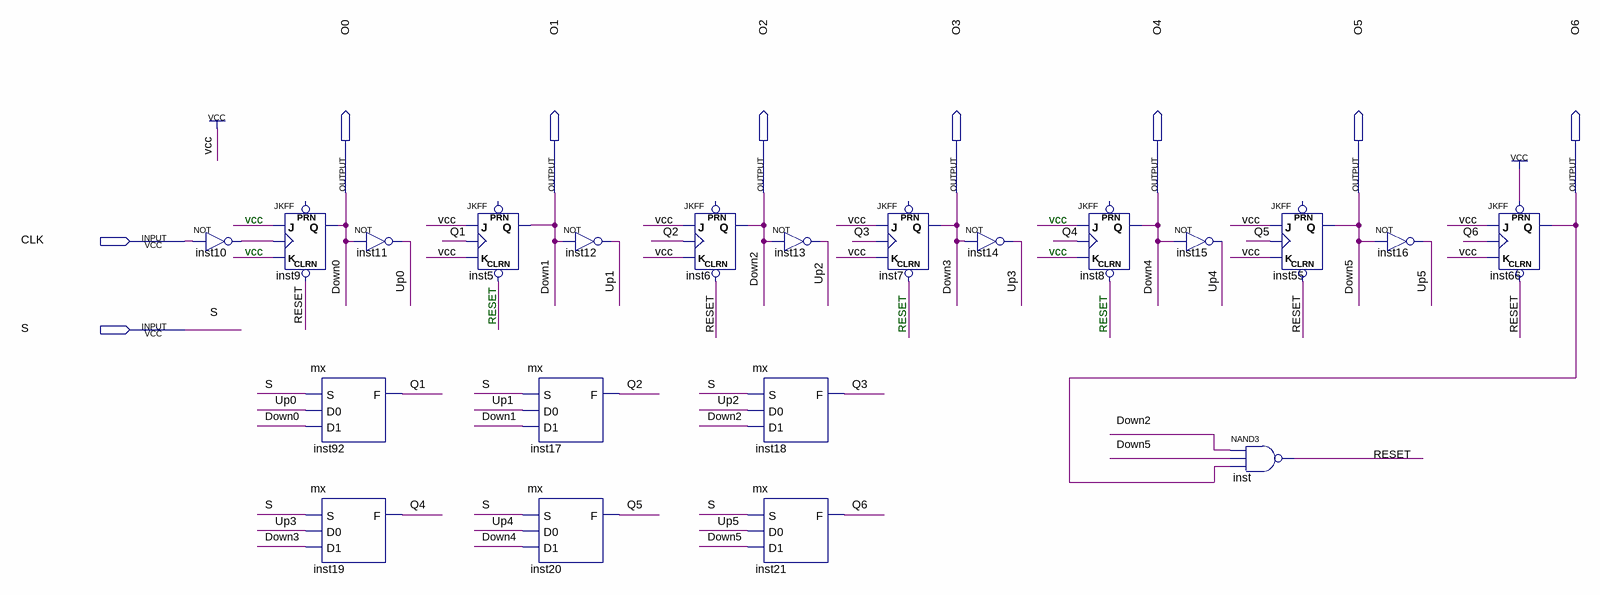
[diagram p0: schematic sheet]
// Quartus schematic UP.bdf as structural Verilog: 21 symbols, 9 pins
module UP (
  input  CLK,
  input  S,
  output O0,
  output O1,
  output O2,
  output O3,
  output O4,
  output O5,
  output O6
);

  wire inst10_out, Q1, Q2, Q3, Q4, Q5, Q6, RESET, Up0, Up1, Up2, Up3, Up4, Up5;

  not inst10 (inst10_out, CLK);
  JKFF inst9 (.CLRN(RESET), .K(1'b1), .J(1'b1), .CLK(inst10_out), .Q(O0));  // open: PRN
  not inst11 (Up0, O0);
  mx inst92 (.S(S), .D0(Up0), .D1(O0), .F(Q1));
  mx inst19 (.S(S), .D0(Up3), .D1(O3), .F(Q4));
  JKFF inst5 (.CLRN(RESET), .K(1'b1), .J(1'b1), .CLK(Q1), .Q(O1));  // open: PRN
  mx inst17 (.S(S), .D0(Up1), .D1(O1), .F(Q2));
  mx inst20 (.S(S), .D0(Up4), .D1(O4), .F(Q5));
  not inst12 (Up1, O1);
  JKFF inst6 (.CLRN(RESET), .K(1'b1), .J(1'b1), .CLK(Q2), .Q(O2));  // open: PRN
  mx inst18 (.S(S), .D0(Up2), .D1(O2), .F(Q3));
  mx inst21 (.S(S), .D0(Up5), .D1(O5), .F(Q6));
  not inst13 (Up2, O2);
  JKFF inst7 (.CLRN(RESET), .K(1'b1), .J(1'b1), .CLK(Q3), .Q(O3));  // open: PRN
  not inst14 (Up3, O3);
  JKFF inst8 (.CLRN(RESET), .K(1'b1), .J(1'b1), .CLK(Q4), .Q(O4));  // open: PRN
  not inst15 (Up4, O4);
  nand inst (RESET, O2, O5, O6);
  JKFF inst55 (.CLRN(RESET), .K(1'b1), .J(1'b1), .CLK(Q5), .Q(O5));  // open: PRN
  not inst16 (Up5, O5);
  JKFF inst66 (.PRN(1'b1), .CLRN(RESET), .K(1'b1), .J(1'b1), .CLK(Q6), .Q(O6));

  // Other names for the same wires on the sheet: Down3 = O3; Down4 = O4; Down0 = O0; Down1 = O1; Down2 = O2;
  //   Down5 = O5

  // Notes on the sheet:
  //   vcc
  //   vcc
  //   vcc
  //   vcc
  //   RESET
  //   RESET
  //   RESET
endmodule
